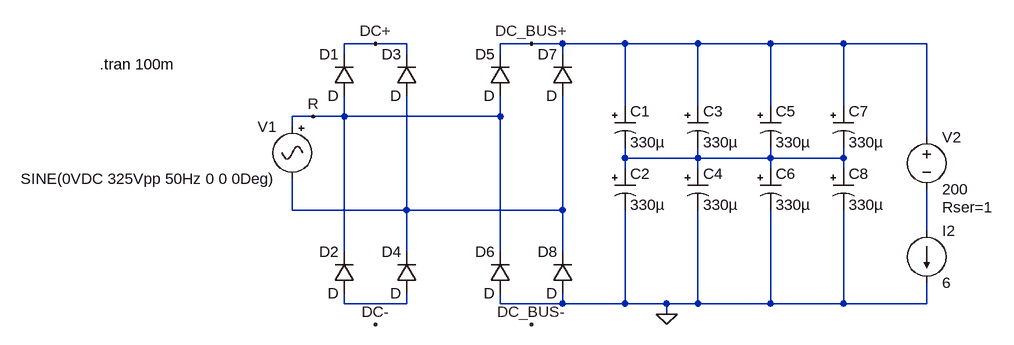
[diagram p0: schematic 2ph AC rectifier (226VAC).asc]
2ph AC rectifier (226VAC).asc, the LTspice schematic file:
Version 4
SHEET 1 1296 680
WIRE 80 -96 32 -96
WIRE 128 -96 80 -96
WIRE 320 -96 272 -96
WIRE 368 -96 320 -96
WIRE 464 -96 368 -96
WIRE 576 -96 464 -96
WIRE 688 -96 576 -96
WIRE 800 -96 688 -96
WIRE 928 -96 800 -96
WIRE 32 -80 32 -96
WIRE 128 -80 128 -96
WIRE 272 -80 272 -96
WIRE 368 -80 368 -96
WIRE 464 0 464 -96
WIRE 576 0 576 -96
WIRE 688 0 688 -96
WIRE 800 0 800 -96
WIRE -16 16 -48 16
WIRE 32 16 32 -16
WIRE 32 16 -16 16
WIRE 272 16 272 -16
WIRE 272 16 32 16
WIRE -48 32 -48 16
WIRE 928 48 928 -96
WIRE 464 80 464 64
WIRE 576 80 576 64
WIRE 576 80 464 80
WIRE 688 80 688 64
WIRE 688 80 576 80
WIRE 800 80 800 64
WIRE 800 80 688 80
WIRE 464 96 464 80
WIRE 576 96 576 80
WIRE 688 96 688 80
WIRE 800 96 800 80
WIRE -48 160 -48 112
WIRE 128 160 128 -16
WIRE 128 160 -48 160
WIRE 368 160 368 -16
WIRE 368 160 128 160
WIRE 928 192 928 128
WIRE 32 224 32 16
WIRE 128 224 128 160
WIRE 272 224 272 16
WIRE 368 224 368 160
WIRE 32 304 32 288
WIRE 128 304 128 288
WIRE 128 304 32 304
WIRE 272 304 272 288
WIRE 368 304 368 288
WIRE 368 304 272 304
WIRE 464 304 464 160
WIRE 464 304 368 304
WIRE 528 304 464 304
WIRE 576 304 576 160
WIRE 576 304 528 304
WIRE 688 304 688 160
WIRE 688 304 576 304
WIRE 800 304 800 160
WIRE 800 304 688 304
WIRE 928 304 928 272
WIRE 928 304 800 304
WIRE 528 320 528 304
FLAG -16 16 R
FLAG 80 336 DC-
FLAG 80 -96 DC+
FLAG 320 336 DC_BUS-
FLAG 528 320 0
FLAG 320 -96 DC_BUS+
SYMBOL Misc\\signal -48 16 M0
WINDOW 123 0 0 Left 2
WINDOW 39 24 132 Left 2
SYMATTR InstName V1
SYMATTR Value SINE(0VDC 325Vpp 50Hz 0 0 0Deg)
SYMBOL diode 48 -16 R180
WINDOW 0 24 64 Left 2
WINDOW 3 24 0 Left 2
SYMATTR InstName D1
SYMBOL diode 48 288 R180
WINDOW 0 24 64 Left 2
WINDOW 3 24 0 Left 2
SYMATTR InstName D2
SYMBOL diode 144 -16 R180
WINDOW 0 24 64 Left 2
WINDOW 3 24 0 Left 2
SYMATTR InstName D3
SYMBOL diode 144 288 R180
WINDOW 0 24 64 Left 2
WINDOW 3 24 0 Left 2
SYMATTR InstName D4
SYMBOL diode 288 -16 R180
WINDOW 0 24 64 Left 2
WINDOW 3 24 0 Left 2
SYMATTR InstName D5
SYMBOL diode 288 288 R180
WINDOW 0 24 64 Left 2
WINDOW 3 24 0 Left 2
SYMATTR InstName D6
SYMBOL diode 384 -16 R180
WINDOW 0 24 64 Left 2
WINDOW 3 24 0 Left 2
SYMATTR InstName D7
SYMBOL diode 384 288 R180
WINDOW 0 24 64 Left 2
WINDOW 3 24 0 Left 2
SYMATTR InstName D8
SYMBOL polcap 448 0 R0
WINDOW 3 24 56 Left 2
SYMATTR Value 330µ
SYMATTR InstName C1
SYMATTR Description Capacitor
SYMATTR Type cap
SYMATTR SpiceLine V=400 Irms=2 Rser=0.603 Lser=0
SYMBOL polcap 448 96 R0
WINDOW 3 24 56 Left 2
SYMATTR Value 330µ
SYMATTR InstName C2
SYMATTR Description Capacitor
SYMATTR Type cap
SYMATTR SpiceLine V=400 Irms=2 Rser=0.603 Lser=0
SYMBOL polcap 560 0 R0
WINDOW 3 24 56 Left 2
SYMATTR Value 330µ
SYMATTR InstName C3
SYMATTR Description Capacitor
SYMATTR Type cap
SYMATTR SpiceLine V=400 Irms=2 Rser=0.603 Lser=0
SYMBOL polcap 560 96 R0
WINDOW 3 24 56 Left 2
SYMATTR Value 330µ
SYMATTR InstName C4
SYMATTR Description Capacitor
SYMATTR Type cap
SYMATTR SpiceLine V=400 Irms=2 Rser=0.603 Lser=0
SYMBOL polcap 672 0 R0
WINDOW 3 24 56 Left 2
SYMATTR Value 330µ
SYMATTR InstName C5
SYMATTR Description Capacitor
SYMATTR Type cap
SYMATTR SpiceLine V=400 Irms=2 Rser=0.603 Lser=0
SYMBOL polcap 672 96 R0
WINDOW 3 24 56 Left 2
SYMATTR Value 330µ
SYMATTR InstName C6
SYMATTR Description Capacitor
SYMATTR Type cap
SYMATTR SpiceLine V=400 Irms=2 Rser=0.603 Lser=0
SYMBOL polcap 784 0 R0
WINDOW 3 24 56 Left 2
SYMATTR Value 330µ
SYMATTR InstName C7
SYMATTR Description Capacitor
SYMATTR Type cap
SYMATTR SpiceLine V=400 Irms=2 Rser=0.603 Lser=0
SYMBOL polcap 784 96 R0
WINDOW 3 24 56 Left 2
SYMATTR Value 330µ
SYMATTR InstName C8
SYMATTR Description Capacitor
SYMATTR Type cap
SYMATTR SpiceLine V=400 Irms=2 Rser=0.603 Lser=0
SYMBOL current 928 192 R0
WINDOW 123 0 0 Left 2
WINDOW 39 0 0 Left 2
SYMATTR InstName I2
SYMATTR Value 6
SYMBOL voltage 928 32 R0
WINDOW 123 0 0 Left 2
WINDOW 39 24 124 Left 2
SYMATTR InstName V2
SYMATTR Value 200
SYMATTR SpiceLine Rser=1
TEXT -344 -64 Left 2 !.tran 100m

The netlist it stands for:
* 2ph AC rectifier (226VAC).asc
V1 R N002 SINE(0VDC 325Vpp 50Hz 0 0 0Deg)
D1 R DC+ D
D2 N004 R D
D3 N002 DC+ D
D4 N004 N002 D
D5 R DC_BUS+ D
D6 0 R D
D7 N002 DC_BUS+ D
D8 0 N002 D
C1 DC_BUS+ N001 330µ V=400 Irms=2 Rser=0.603 Lser=0
C2 N001 0 330µ V=400 Irms=2 Rser=0.603 Lser=0
C3 DC_BUS+ N001 330µ V=400 Irms=2 Rser=0.603 Lser=0
C4 N001 0 330µ V=400 Irms=2 Rser=0.603 Lser=0
C5 DC_BUS+ N001 330µ V=400 Irms=2 Rser=0.603 Lser=0
C6 N001 0 330µ V=400 Irms=2 Rser=0.603 Lser=0
C7 DC_BUS+ N001 330µ V=400 Irms=2 Rser=0.603 Lser=0
C8 N001 0 330µ V=400 Irms=2 Rser=0.603 Lser=0
I2 N003 0 6
V2 DC_BUS+ N003 200 Rser=1
.model D D
.lib standard.dio
.tran 100m
.backanno
.end